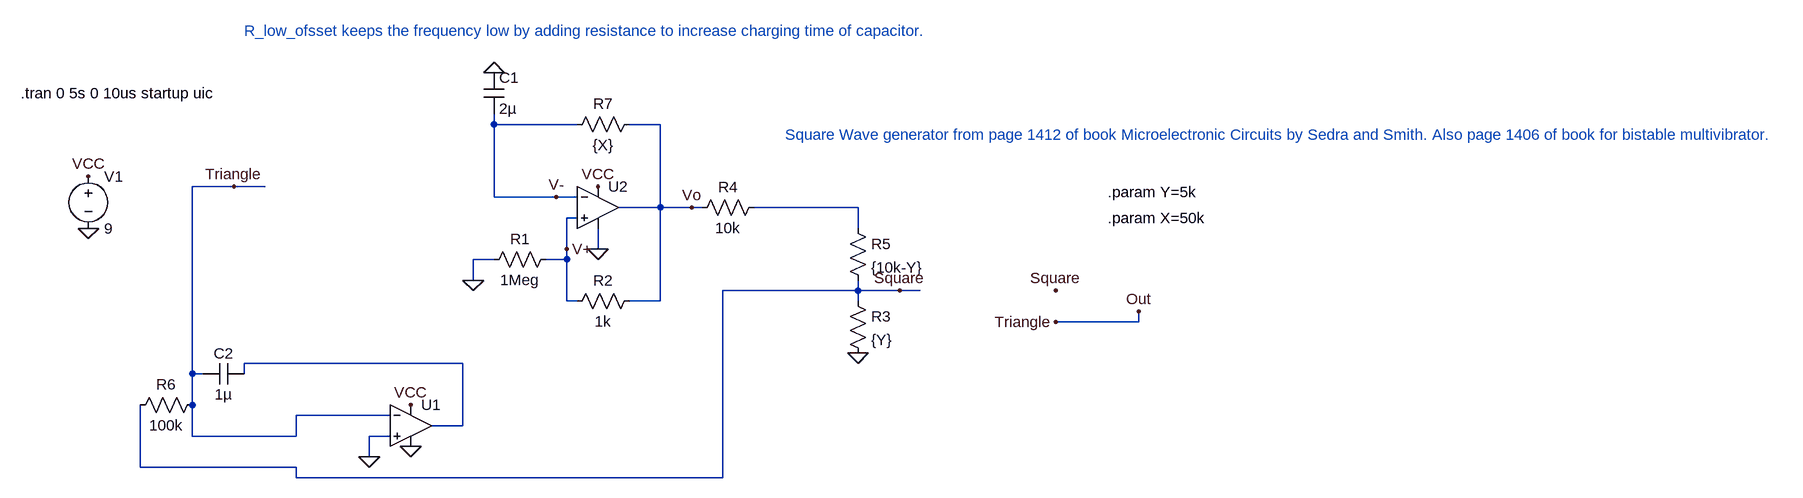
[diagram p0: schematic LFO-triangle-square.asc]
LFO-triangle-square.asc, the LTspice schematic file:
Version 4
SHEET 1 5224 1764
WIRE 2704 -16 2704 -32
WIRE 2832 -16 2704 -16
WIRE 2960 -16 2912 -16
WIRE 2304 80 2240 80
WIRE 2352 80 2304 80
WIRE 2704 96 2704 -16
WIRE 2800 96 2704 96
WIRE 2832 96 2800 96
WIRE 2960 112 2960 -16
WIRE 2960 112 2896 112
WIRE 3008 112 2960 112
WIRE 3024 112 3008 112
WIRE 3264 112 3104 112
WIRE 2832 128 2816 128
WIRE 3264 144 3264 112
WIRE 2816 176 2816 128
WIRE 2864 176 2864 144
WIRE 2704 192 2672 192
WIRE 2816 192 2816 176
WIRE 2816 192 2784 192
WIRE 2672 224 2672 192
WIRE 3264 240 3264 224
WIRE 3264 240 3056 240
WIRE 3328 240 3264 240
WIRE 3360 240 3328 240
WIRE 2816 256 2816 192
WIRE 2832 256 2816 256
WIRE 2960 256 2960 112
WIRE 2960 256 2912 256
WIRE 3264 256 3264 240
WIRE 3696 288 3696 272
WIRE 3696 288 3568 288
WIRE 2656 352 2320 352
WIRE 2240 368 2240 80
WIRE 2256 368 2240 368
WIRE 2320 368 2320 352
WIRE 2240 416 2240 368
WIRE 2544 432 2400 432
WIRE 2656 448 2656 352
WIRE 2656 448 2608 448
WIRE 2240 464 2240 416
WIRE 2400 464 2400 432
WIRE 2400 464 2240 464
WIRE 2544 464 2512 464
WIRE 2512 496 2512 464
WIRE 2160 512 2160 416
WIRE 2400 512 2160 512
WIRE 2400 528 2400 512
WIRE 3056 528 3056 240
WIRE 3056 528 2400 528
FLAG 2864 80 VCC
FLAG 2864 176 0
FLAG 3008 112 Vo
FLAG 2800 96 V-
FLAG 2816 176 V+
FLAG 2080 144 0
FLAG 2080 64 VCC
FLAG 3264 336 0
FLAG 2576 416 VCC
FLAG 2576 480 0
FLAG 2304 80 Triangle
FLAG 2672 224 0
FLAG 2512 496 0
FLAG 2704 -96 0
FLAG 3696 272 Out
FLAG 3328 240 Square
FLAG 3568 240 Square
FLAG 3568 288 Triangle
SYMBOL Opamps\\UniversalOpamp2 2864 112 R0
SYMATTR InstName U2
SYMBOL res 2800 176 R90
WINDOW 0 0 56 VBottom 2
WINDOW 3 32 56 VTop 2
SYMATTR InstName R1
SYMATTR Value 1Meg
SYMBOL res 2928 240 R90
WINDOW 0 0 56 VBottom 2
WINDOW 3 32 56 VTop 2
SYMATTR InstName R2
SYMATTR Value 1k
SYMBOL voltage 2080 48 R0
WINDOW 123 0 0 Left 0
WINDOW 39 0 0 Left 0
SYMATTR InstName V1
SYMATTR Value 9
SYMBOL res 3120 96 R90
WINDOW 0 0 56 VBottom 2
WINDOW 3 32 56 VTop 2
SYMATTR InstName R4
SYMATTR Value 10k
SYMBOL res 3248 128 R0
SYMATTR InstName R5
SYMATTR Value {10k-Y}
SYMBOL res 3248 240 R0
SYMATTR InstName R3
SYMATTR Value {Y}
SYMBOL Opamps\\UniversalOpamp2 2576 448 R0
SYMATTR InstName U1
SYMBOL res 2256 400 R90
WINDOW 0 0 56 VBottom 2
WINDOW 3 32 56 VTop 2
SYMATTR InstName R6
SYMATTR Value 100k
SYMBOL cap 2320 352 R90
WINDOW 0 0 32 VBottom 2
WINDOW 3 32 32 VTop 2
SYMATTR InstName C2
SYMATTR Value 1µ
SYMBOL res 2928 -32 R90
WINDOW 0 0 56 VBottom 2
WINDOW 3 32 56 VTop 2
SYMATTR InstName R7
SYMATTR Value {X}
SYMBOL cap 2688 -96 R0
SYMATTR InstName C1
SYMATTR Value 2µ
TEXT 1976 -64 Left 2 !.tran 0 5s 0 10us startup uic
TEXT 2320 -160 Left 2 ;R_low_ofsset keeps the frequency low by adding resistance to increase charging time of capacitor.
TEXT 3152 0 Left 2 ;Square Wave generator from page 1412 of book Microelectronic Circuits by Sedra and Smith. Also page 1406 of book for bistable multivibrator.
TEXT 3648 128 Left 2 !.param X=50k
TEXT 3648 88 Left 2 !.param Y=5k

The netlist it stands for:
* LFO-triangle-square.asc
XU2 V+ V- VCC 0 Vo level.2 Avol=1Meg GBW=10Meg Slew=10Meg ilimit=25m rail=0 Vos=0 phimargin=45 en=0 enk=0 in=0 ink=0 Rin=500Meg  ; pins IN+ IN- V+ V- OUT
R1 V+ 0 1Meg
R2 Vo V+ 1k
V1 VCC 0 9
R4 N001 Vo 10k
R5 N001 Square {10k-Y}
R3 Square 0 {Y}
XU1 0 Out VCC 0 N002 level.2 Avol=1Meg GBW=10Meg Slew=10Meg ilimit=25m rail=0 Vos=0 phimargin=45 en=0 enk=0 in=0 ink=0 Rin=500Meg  ; pins IN+ IN- V+ V- OUT
R6 Out Square 100k
C2 N002 Out 1µ
R7 Vo V- {X}
C1 0 V- 2µ
.tran 0 5s 0 10us startup uic
* R_low_ofsset keeps the frequency low by adding resistance to increase charging time of capacitor.
* Square Wave generator from page 1412 of book Microelectronic Circuits by Sedra and Smith. Also page 1406 of book for bistable multivibrator.
.param X=50k
.param Y=5k
.lib UniversalOpamps2.sub
.backanno
.end